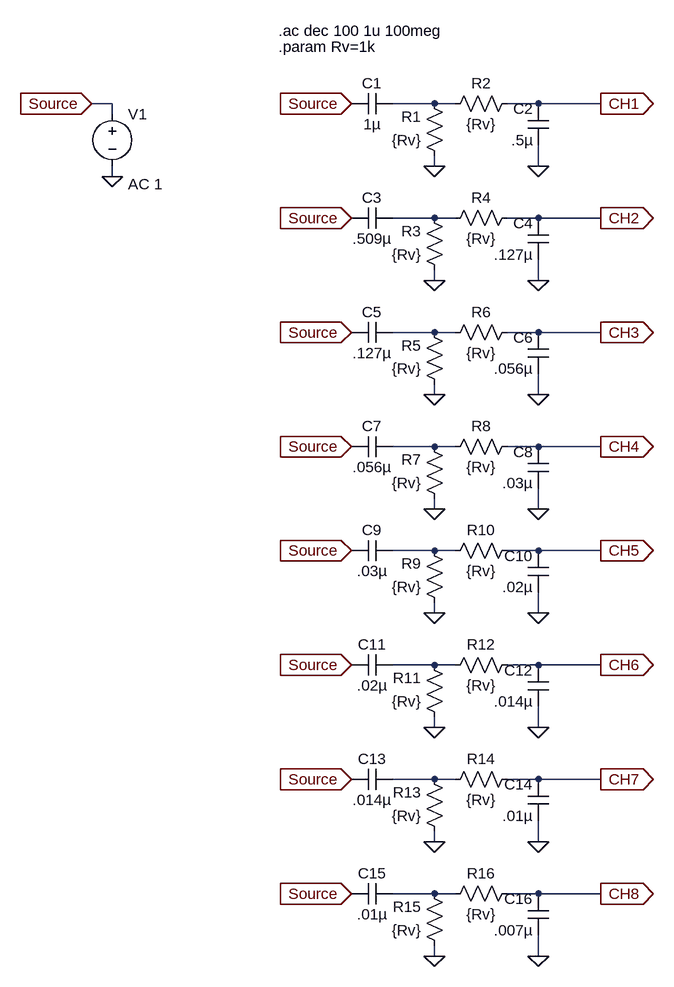
[diagram p0: schematic Filters.asc]
Filters.asc, the LTspice schematic file:
Version 4
SHEET 1 1796 1428
WIRE -304 96 -336 96
WIRE 192 96 128 96
WIRE 224 96 192 96
WIRE 352 96 304 96
WIRE 448 96 352 96
WIRE -304 112 -304 96
WIRE 192 192 192 176
WIRE 352 192 352 160
WIRE -304 208 -304 192
WIRE 192 272 128 272
WIRE 224 272 192 272
WIRE 352 272 304 272
WIRE 448 272 352 272
WIRE 192 368 192 352
WIRE 352 368 352 336
WIRE 192 448 128 448
WIRE 224 448 192 448
WIRE 352 448 304 448
WIRE 448 448 352 448
WIRE 192 544 192 528
WIRE 352 544 352 512
WIRE 192 624 128 624
WIRE 224 624 192 624
WIRE 352 624 304 624
WIRE 448 624 352 624
WIRE 192 720 192 704
WIRE 352 720 352 688
WIRE 192 784 128 784
WIRE 224 784 192 784
WIRE 352 784 304 784
WIRE 448 784 352 784
WIRE 192 880 192 864
WIRE 352 880 352 848
WIRE 192 960 128 960
WIRE 224 960 192 960
WIRE 352 960 304 960
WIRE 448 960 352 960
WIRE 192 1056 192 1040
WIRE 352 1056 352 1024
WIRE 192 1136 128 1136
WIRE 224 1136 192 1136
WIRE 352 1136 304 1136
WIRE 448 1136 352 1136
WIRE 192 1232 192 1216
WIRE 352 1232 352 1200
WIRE 192 1312 128 1312
WIRE 224 1312 192 1312
WIRE 352 1312 304 1312
WIRE 448 1312 352 1312
WIRE 192 1408 192 1392
WIRE 352 1408 352 1376
FLAG -304 208 0
FLAG 192 192 0
FLAG 352 192 0
FLAG 192 368 0
FLAG 352 368 0
FLAG 192 544 0
FLAG 352 544 0
FLAG 192 720 0
FLAG 352 720 0
FLAG 192 880 0
FLAG 352 880 0
FLAG 192 1056 0
FLAG 352 1056 0
FLAG 192 1232 0
FLAG 352 1232 0
FLAG 192 1408 0
FLAG 352 1408 0
FLAG -336 96 Source
IOPIN -336 96 In
FLAG 64 272 Source
IOPIN 64 272 In
FLAG 64 96 Source
IOPIN 64 96 In
FLAG 64 448 Source
IOPIN 64 448 In
FLAG 64 1312 Source
IOPIN 64 1312 In
FLAG 64 1136 Source
IOPIN 64 1136 In
FLAG 64 960 Source
IOPIN 64 960 In
FLAG 64 784 Source
IOPIN 64 784 In
FLAG 64 624 Source
IOPIN 64 624 In
FLAG 448 96 CH1
IOPIN 448 96 Out
FLAG 448 272 CH2
IOPIN 448 272 Out
FLAG 448 448 CH3
IOPIN 448 448 Out
FLAG 448 624 CH4
IOPIN 448 624 Out
FLAG 448 784 CH5
IOPIN 448 784 Out
FLAG 448 960 CH6
IOPIN 448 960 Out
FLAG 448 1136 CH7
IOPIN 448 1136 Out
FLAG 448 1312 CH8
IOPIN 448 1312 Out
SYMBOL cap 128 80 R90
WINDOW 0 0 32 VBottom 2
WINDOW 3 32 32 VTop 2
SYMATTR InstName C1
SYMATTR Value 1µ
SYMBOL cap 368 160 R180
WINDOW 0 24 56 Left 2
WINDOW 3 24 8 Left 2
SYMATTR InstName C2
SYMATTR Value .5µ
SYMBOL res 208 192 R180
WINDOW 0 36 76 Left 2
WINDOW 3 36 40 Left 2
SYMATTR InstName R1
SYMATTR Value {Rv}
SYMBOL res 320 80 R90
WINDOW 0 0 56 VBottom 2
WINDOW 3 32 56 VTop 2
SYMATTR InstName R2
SYMATTR Value {Rv}
SYMBOL voltage -304 96 R0
WINDOW 123 24 124 Left 2
WINDOW 39 0 0 Left 0
SYMATTR InstName V1
SYMATTR Value ""
SYMATTR Value2 AC 1
SYMBOL cap 128 256 R90
WINDOW 0 0 32 VBottom 2
WINDOW 3 32 32 VTop 2
SYMATTR InstName C3
SYMATTR Value .509µ
SYMBOL cap 368 336 R180
WINDOW 0 24 56 Left 2
WINDOW 3 24 8 Left 2
SYMATTR InstName C4
SYMATTR Value .127µ
SYMBOL res 208 368 R180
WINDOW 0 36 76 Left 2
WINDOW 3 36 40 Left 2
SYMATTR InstName R3
SYMATTR Value {Rv}
SYMBOL res 320 256 R90
WINDOW 0 0 56 VBottom 2
WINDOW 3 32 56 VTop 2
SYMATTR InstName R4
SYMATTR Value {Rv}
SYMBOL cap 128 432 R90
WINDOW 0 0 32 VBottom 2
WINDOW 3 32 32 VTop 2
SYMATTR InstName C5
SYMATTR Value .127µ
SYMBOL cap 368 512 R180
WINDOW 0 24 56 Left 2
WINDOW 3 24 8 Left 2
SYMATTR InstName C6
SYMATTR Value .056µ
SYMBOL res 208 544 R180
WINDOW 0 36 76 Left 2
WINDOW 3 36 40 Left 2
SYMATTR InstName R5
SYMATTR Value {Rv}
SYMBOL res 320 432 R90
WINDOW 0 0 56 VBottom 2
WINDOW 3 32 56 VTop 2
SYMATTR InstName R6
SYMATTR Value {Rv}
SYMBOL cap 128 608 R90
WINDOW 0 0 32 VBottom 2
WINDOW 3 32 32 VTop 2
SYMATTR InstName C7
SYMATTR Value .056µ
SYMBOL cap 368 688 R180
WINDOW 0 24 56 Left 2
WINDOW 3 24 8 Left 2
SYMATTR InstName C8
SYMATTR Value .03µ
SYMBOL res 208 720 R180
WINDOW 0 36 76 Left 2
WINDOW 3 36 40 Left 2
SYMATTR InstName R7
SYMATTR Value {Rv}
SYMBOL res 320 608 R90
WINDOW 0 0 56 VBottom 2
WINDOW 3 32 56 VTop 2
SYMATTR InstName R8
SYMATTR Value {Rv}
SYMBOL cap 128 768 R90
WINDOW 0 0 32 VBottom 2
WINDOW 3 32 32 VTop 2
SYMATTR InstName C9
SYMATTR Value .03µ
SYMBOL cap 368 848 R180
WINDOW 0 24 56 Left 2
WINDOW 3 24 8 Left 2
SYMATTR InstName C10
SYMATTR Value .02µ
SYMBOL res 208 880 R180
WINDOW 0 36 76 Left 2
WINDOW 3 36 40 Left 2
SYMATTR InstName R9
SYMATTR Value {Rv}
SYMBOL res 320 768 R90
WINDOW 0 0 56 VBottom 2
WINDOW 3 32 56 VTop 2
SYMATTR InstName R10
SYMATTR Value {Rv}
SYMBOL cap 128 944 R90
WINDOW 0 0 32 VBottom 2
WINDOW 3 32 32 VTop 2
SYMATTR InstName C11
SYMATTR Value .02µ
SYMBOL cap 368 1024 R180
WINDOW 0 24 56 Left 2
WINDOW 3 24 8 Left 2
SYMATTR InstName C12
SYMATTR Value .014µ
SYMBOL res 208 1056 R180
WINDOW 0 36 76 Left 2
WINDOW 3 36 40 Left 2
SYMATTR InstName R11
SYMATTR Value {Rv}
SYMBOL res 320 944 R90
WINDOW 0 0 56 VBottom 2
WINDOW 3 32 56 VTop 2
SYMATTR InstName R12
SYMATTR Value {Rv}
SYMBOL cap 128 1120 R90
WINDOW 0 0 32 VBottom 2
WINDOW 3 32 32 VTop 2
SYMATTR InstName C13
SYMATTR Value .014µ
SYMBOL cap 368 1200 R180
WINDOW 0 24 56 Left 2
WINDOW 3 24 8 Left 2
SYMATTR InstName C14
SYMATTR Value .01µ
SYMBOL res 208 1232 R180
WINDOW 0 36 76 Left 2
WINDOW 3 36 40 Left 2
SYMATTR InstName R13
SYMATTR Value {Rv}
SYMBOL res 320 1120 R90
WINDOW 0 0 56 VBottom 2
WINDOW 3 32 56 VTop 2
SYMATTR InstName R14
SYMATTR Value {Rv}
SYMBOL cap 128 1296 R90
WINDOW 0 0 32 VBottom 2
WINDOW 3 32 32 VTop 2
SYMATTR InstName C15
SYMATTR Value .01µ
SYMBOL cap 368 1376 R180
WINDOW 0 24 56 Left 2
WINDOW 3 24 8 Left 2
SYMATTR InstName C16
SYMATTR Value .007µ
SYMBOL res 208 1408 R180
WINDOW 0 36 76 Left 2
WINDOW 3 36 40 Left 2
SYMATTR InstName R15
SYMATTR Value {Rv}
SYMBOL res 320 1296 R90
WINDOW 0 0 56 VBottom 2
WINDOW 3 32 56 VTop 2
SYMATTR InstName R16
SYMATTR Value {Rv}
TEXT -48 -16 Left 2 !.ac dec 100 1u 100meg
TEXT -48 8 Left 2 !.param Rv=1k

The netlist it stands for:
* Filters.asc
C1 N001 Source 1µ
C2 0 CH1 .5µ
R1 0 N001 {Rv}
R2 CH1 N001 {Rv}
V1 Source 0 AC 1
C3 N002 Source .509µ
C4 0 CH2 .127µ
R3 0 N002 {Rv}
R4 CH2 N002 {Rv}
C5 N003 Source .127µ
C6 0 CH3 .056µ
R5 0 N003 {Rv}
R6 CH3 N003 {Rv}
C7 N004 Source .056µ
C8 0 CH4 .03µ
R7 0 N004 {Rv}
R8 CH4 N004 {Rv}
C9 N005 Source .03µ
C10 0 CH5 .02µ
R9 0 N005 {Rv}
R10 CH5 N005 {Rv}
C11 N006 Source .02µ
C12 0 CH6 .014µ
R11 0 N006 {Rv}
R12 CH6 N006 {Rv}
C13 N007 Source .014µ
C14 0 CH7 .01µ
R13 0 N007 {Rv}
R14 CH7 N007 {Rv}
C15 N008 Source .01µ
C16 0 CH8 .007µ
R15 0 N008 {Rv}
R16 CH8 N008 {Rv}
.ac dec 100 1u 100meg
.param Rv=1k
.backanno
.end